# Altium schematic sheet io.SchDoc
size A2
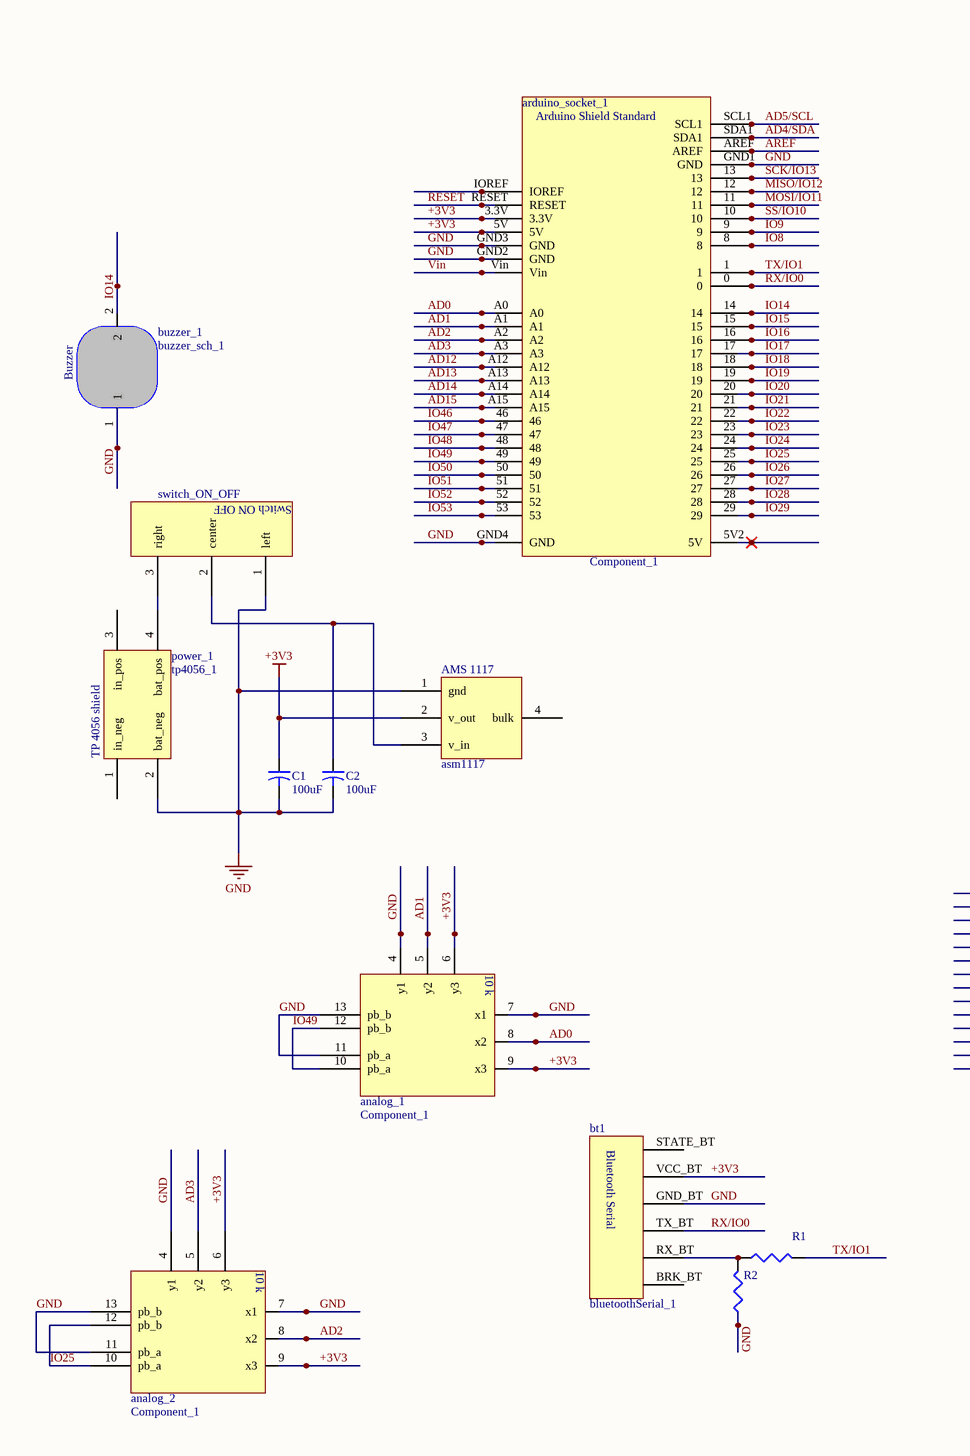
[diagram p0: io.SchDoc, left]
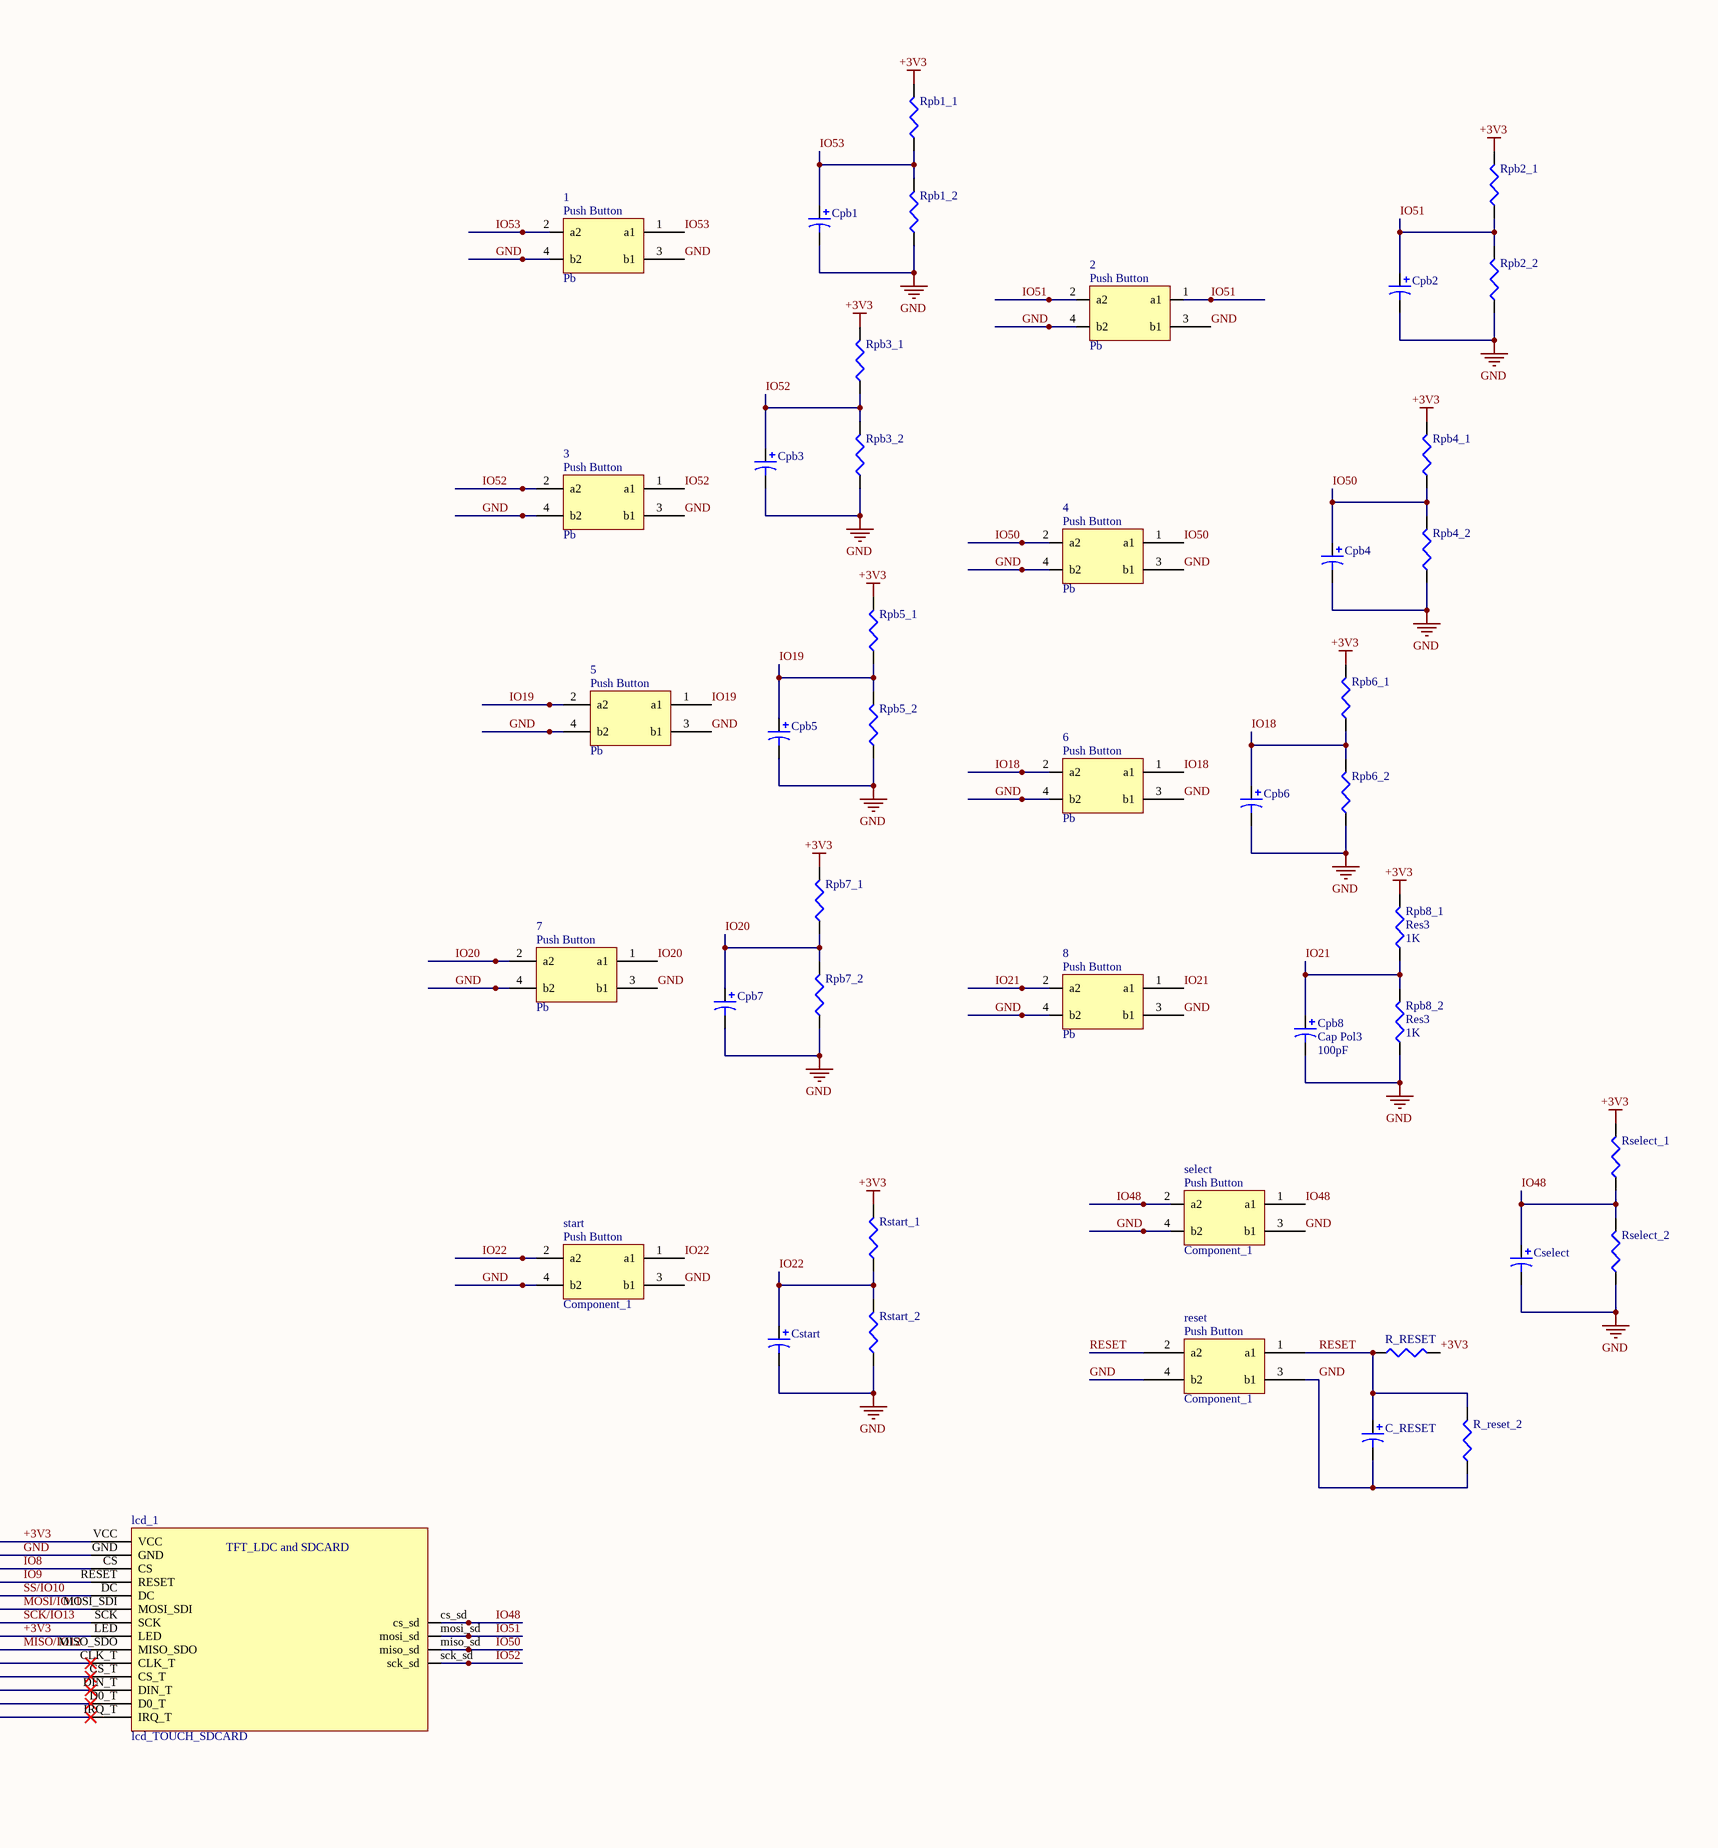
[diagram p1: io.SchDoc, right]

## Parts
1  Pb  [PCBComponent_1]
2  Pb  [PCBComponent_1]
3  Pb  [PCBComponent_1]
4  Pb  [PCBComponent_1]
5  Pb  [PCBComponent_1]
6  Pb  [PCBComponent_1]
7  Pb  [PCBComponent_1]
8  Pb  [PCBComponent_1]
analog_1  Component_1  [PCBComponent_1]
analog_2  Component_1  [PCBComponent_1]
arduino_socket_1  Component_1  [arduino_due_cutPin]
asm1117  Component_1  [sot223_plasticPackage]  (value not drawn)
bt1  bluetoothSerial_1  [bluetoothSerial_header]
buzzer_1  buzzer_sch_1  [buzzer_pcb_1]
C1  value 100uF  [capaEletrolitic_100uF_25v_smd]  (hidden comment: Cap2)
C2  value 100uF  [capaEletrolitic_100uF_25v_smd]  (hidden comment: Cap2)
C_RESET  Cap Pol3  [C0805]  (value not drawn)
Cpb1  Cap Pol3  [C0805]  (value not drawn)
Cpb2  Cap Pol3  [C0805]  (value not drawn)
Cpb3  Cap Pol3  [C0805]  (value not drawn)
Cpb4  Cap Pol3  [C0805]  (value not drawn)
Cpb5  Cap Pol3  [C0805]  (value not drawn)
Cpb6  Cap Pol3  [C0805]  (value not drawn)
Cpb7  Cap Pol3  [C0805]  (value not drawn)
Cpb8  Cap Pol3  value 100pF  [C0805]
Cselect  Cap Pol3  [C0805]  (value not drawn)
Cstart  Cap Pol3  [C0805]  (value not drawn)
lcd_1  lcd_TOUCH_SDCARD  [PCB_LCDandTOUCH]
power_1  tp4056_1  [tp4056pcb_1]
R1  Res3  [J1-0603]  (value not drawn)
R2  Res3  [J1-0603]  (value not drawn)
R_RESET  Res3  [J1-0603]  (value not drawn)
R_reset_2  Res3  [J1-0603]  (value not drawn)
reset  Component_1  [pb_6mm_1]
Rpb1_1  Res3  [J1-0603]  (value not drawn)
Rpb1_2  Res3  [J1-0603]  (value not drawn)
Rpb2_1  Res3  [J1-0603]  (value not drawn)
Rpb2_2  Res3  [J1-0603]  (value not drawn)
Rpb3_1  Res3  [J1-0603]  (value not drawn)
Rpb3_2  Res3  [J1-0603]  (value not drawn)
Rpb4_1  Res3  [J1-0603]  (value not drawn)
Rpb4_2  Res3  [J1-0603]  (value not drawn)
Rpb5_1  Res3  [J1-0603]  (value not drawn)
Rpb5_2  Res3  [J1-0603]  (value not drawn)
Rpb6_1  Res3  [J1-0603]  (value not drawn)
Rpb6_2  Res3  [J1-0603]  (value not drawn)
Rpb7_1  Res3  [J1-0603]  (value not drawn)
Rpb7_2  Res3  [J1-0603]  (value not drawn)
Rpb8_1  Res3  value 1K  [J1-0603]
Rpb8_2  Res3  value 1K  [J1-0603]
Rselect_1  Res3  [J1-0603]  (value not drawn)
Rselect_2  Res3  [J1-0603]  (value not drawn)
Rstart_1  Res3  [J1-0603]  (value not drawn)
Rstart_2  Res3  [J1-0603]  (value not drawn)
select  Component_1  [PCBComponent_1]
start  Component_1  [PCBComponent_1]
switch_ON_OFF  switch_ON_OFF_1  [PCBComponent_1]  (value not drawn)

## Nets
+3V3: analog_1.6(y3) analog_1.9(x3) analog_2.6(y3) analog_2.9(x3) arduino_socket_1.3.3V arduino_socket_1.5V asm1117.2(v_out) bt1.VCC_BT C1.1 lcd_1.LED lcd_1.VCC R_RESET.2 Rpb1_1.2 Rpb2_1.2 Rpb3_1.2 Rpb4_1.2 Rpb5_1.2 Rpb6_1.2 Rpb7_1.2 Rpb8_1.2 Rselect_1.2 Rstart_1.2
GND: 1.3(b1) 1.4(b2) 2.3(b1) 2.4(b2) 3.3(b1) 3.4(b2) 4.3(b1) 4.4(b2) 5.3(b1) 5.4(b2) 6.3(b1) 6.4(b2) 7.3(b1) 7.4(b2) 8.3(b1) 8.4(b2) analog_1.4(y1) analog_1.7(x1) analog_1.11(pb_a) analog_1.13(pb_b) analog_2.4(y1) analog_2.7(x1) analog_2.11(pb_a) analog_2.13(pb_b) arduino_socket_1.GND1(GND) arduino_socket_1.GND2(GND) arduino_socket_1.GND3(GND) arduino_socket_1.GND4(GND) asm1117.1(gnd) bt1.GND_BT buzzer_1.1 C1.2 C2.2 C_RESET.2 Cpb1.2 Cpb2.2 Cpb3.2 Cpb4.2 Cpb5.2 Cpb6.2 Cpb7.2 Cpb8.2 Cselect.2 Cstart.2 lcd_1.GND power_1.2(bat_neg) R2.1 R_reset_2.1 reset.3(b1) reset.4(b2) Rpb1_2.1 Rpb2_2.1 Rpb3_2.1 Rpb4_2.1 Rpb5_2.1 Rpb6_2.1 Rpb7_2.1 Rpb8_2.1 Rselect_2.1 Rstart_2.1 select.3(b1) select.4(b2) start.3(b1) start.4(b2) switch_ON_OFF.1(left)
AD0: analog_1.8(x2) arduino_socket_1.A0
AD1: analog_1.5(y2) arduino_socket_1.A1
AD2: analog_2.8(x2) arduino_socket_1.A2
AD3: analog_2.5(y2) arduino_socket_1.A3
AD4/SDA: arduino_socket_1.SDA1
AD5/SCL: arduino_socket_1.SCL1
AD12: arduino_socket_1.A12
AD13: arduino_socket_1.A13
AD14: arduino_socket_1.A14
AD15: arduino_socket_1.A15
AREF: arduino_socket_1.AREF
IO8: arduino_socket_1.8 lcd_1.CS
IO9: arduino_socket_1.9 lcd_1.RESET
IO14: arduino_socket_1.14 buzzer_1.2
IO15: arduino_socket_1.15
IO16: arduino_socket_1.16
IO17: arduino_socket_1.17
IO18: 6.1(a1) 6.2(a2) arduino_socket_1.18 Cpb6.1 Rpb6_1.1 Rpb6_2.2
IO19: 5.1(a1) 5.2(a2) arduino_socket_1.19 Cpb5.1 Rpb5_1.1 Rpb5_2.2
IO20: 7.1(a1) 7.2(a2) arduino_socket_1.20 Cpb7.1 Rpb7_1.1 Rpb7_2.2
IO21: 8.1(a1) 8.2(a2) arduino_socket_1.21 Cpb8.1 Rpb8_1.1 Rpb8_2.2
IO22: arduino_socket_1.22 Cstart.1 Rstart_1.1 Rstart_2.2 start.1(a1) start.2(a2)
IO23: arduino_socket_1.23
IO24: arduino_socket_1.24
IO25: analog_2.10(pb_a) analog_2.12(pb_b) arduino_socket_1.25
IO26: arduino_socket_1.26
IO27: arduino_socket_1.27
IO28: arduino_socket_1.28
IO29: arduino_socket_1.29
IO46: arduino_socket_1.46
IO47: arduino_socket_1.47
IO48: arduino_socket_1.48 Cselect.1 lcd_1.cs_sd Rselect_1.1 Rselect_2.2 select.1(a1) select.2(a2)
IO49: analog_1.10(pb_a) analog_1.12(pb_b) arduino_socket_1.49
IO50: 4.1(a1) 4.2(a2) arduino_socket_1.50 Cpb4.1 lcd_1.miso_sd Rpb4_1.1 Rpb4_2.2
IO51: 2.1(a1) 2.2(a2) arduino_socket_1.51 Cpb2.1 lcd_1.mosi_sd Rpb2_1.1 Rpb2_2.2
IO52: 3.1(a1) 3.2(a2) arduino_socket_1.52 Cpb3.1 lcd_1.sck_sd Rpb3_1.1 Rpb3_2.2
IO53: 1.1(a1) 1.2(a2) arduino_socket_1.53 Cpb1.1 Rpb1_1.1 Rpb1_2.2
MISO/IO12: arduino_socket_1.12 lcd_1.MISO_SDO
MOSI/IO11: arduino_socket_1.11 lcd_1.MOSI_SDI
RESET: arduino_socket_1.RESET C_RESET.1 R_RESET.1 R_reset_2.2 reset.1(a1) reset.2(a2)
RX/IO0: arduino_socket_1.0 bt1.TX_BT
SCK/IO13: arduino_socket_1.13 lcd_1.SCK
SS/IO10: arduino_socket_1.10 lcd_1.DC
TX/IO1: arduino_socket_1.1 R1.2
Vin: arduino_socket_1.Vin
Netasm1117_3: asm1117.3(v_in) C2.1 switch_ON_OFF.2(center)
Netbt1_RX_BT: bt1.RX_BT R1.1 R2.2
Netpower_1_4: power_1.4(bat_pos) switch_ON_OFF.3(right)

Not connected (* = marked no-connect by the designer): arduino_socket_1 5V2(5V)* IOREF; asm1117 4(bulk); bt1 BRK_BT STATE_BT; lcd_1 CLK_T* CS_T* D0_T* DIN_T* IRQ_T*; power_1 1(in_neg) 3(in_pos)

## Notes on the sheet
- Title
- Size:
- Date:
- File:
- A2
- Number:
- Time:
- Revision:
- Sheet
- of
- (in symbol bluetoothSerial_1) Bluetooth Serial
- (in symbol buzzer_sch_1) Buzzer
- (in symbol Component_1) Push Button; 10 k; Arduino Shield Standard; AMS 1117
- (in symbol lcd_TOUCH_SDCARD) TFT_LDC and SDCARD
- (in symbol switch_ON_OFF_1) Switch ON OFF
- (in symbol tp4056_1) TP 4056 shield

## Library data of the parts
1-8 = Component_1
C1 C2 = Cap2: Capacitor; Published: 23-Sep-2002; PackageReference: CAPR5-4X5; Publisher: Altium Limited; PackageDescription: Capacitor; 2 Leads
C_RESET Cpb1-Cpb7 Cselect Cstart = Cap Pol3: Polarized Capacitor (Surface Mount); Value: 100pF; Published: 8-Jun-2000; LatestRevisionDate: 29-May-2009; LatestRevisionNote: IPC-7351 Footprint Added.; PackageReference: C0805; Publisher: Altium Limited; PackageDescription: Chip Capacitor
Cpb8 = Cap Pol3: Polarized Capacitor (Surface Mount); Published: 8-Jun-2000; LatestRevisionDate: 29-May-2009; LatestRevisionNote: IPC-7351 Footprint Added.; PackageReference: C0805; Publisher: Altium Limited; PackageDescription: Chip Capacitor
R1 R2 R_RESET R_reset_2 Rpb1_1 Rpb1_2 Rpb2_1 Rpb2_2 Rpb3_1 Rpb3_2 Rpb4_1 Rpb4_2 Rpb5_1 Rpb5_2 Rpb6_1 Rpb6_2 Rpb7_1 Rpb7_2 Rselect_1 Rselect_2 Rstart_1 Rstart_2 = Res3: Resistor; Value: 1K; Published: 8-Jun-2000; LatestRevisionDate: 29-May-2009; LatestRevisionNote: IPC-7351 Footprint Added.; PackageReference: J1-0603; Publisher: Altium Limited; PackageDescription: Chip Resistor
Rpb8_1 Rpb8_2 = Res3: Resistor; Published: 8-Jun-2000; LatestRevisionDate: 29-May-2009; LatestRevisionNote: IPC-7351 Footprint Added.; PackageReference: J1-0603; Publisher: Altium Limited; PackageDescription: Chip Resistor